# Altium schematic sheet 0_Architecture.SchDoc
size A4; Organization: SpaceLab UFSC; Address1: UFSC - SpaceLab; Address2: University Campus - Trindade; Address3: Dep. of Electrical Engineering - CTC; Address4: Florianópolis, Santa Catarina, Brazil; Revision: 1.0; Address5: CEP: 88040 - 900
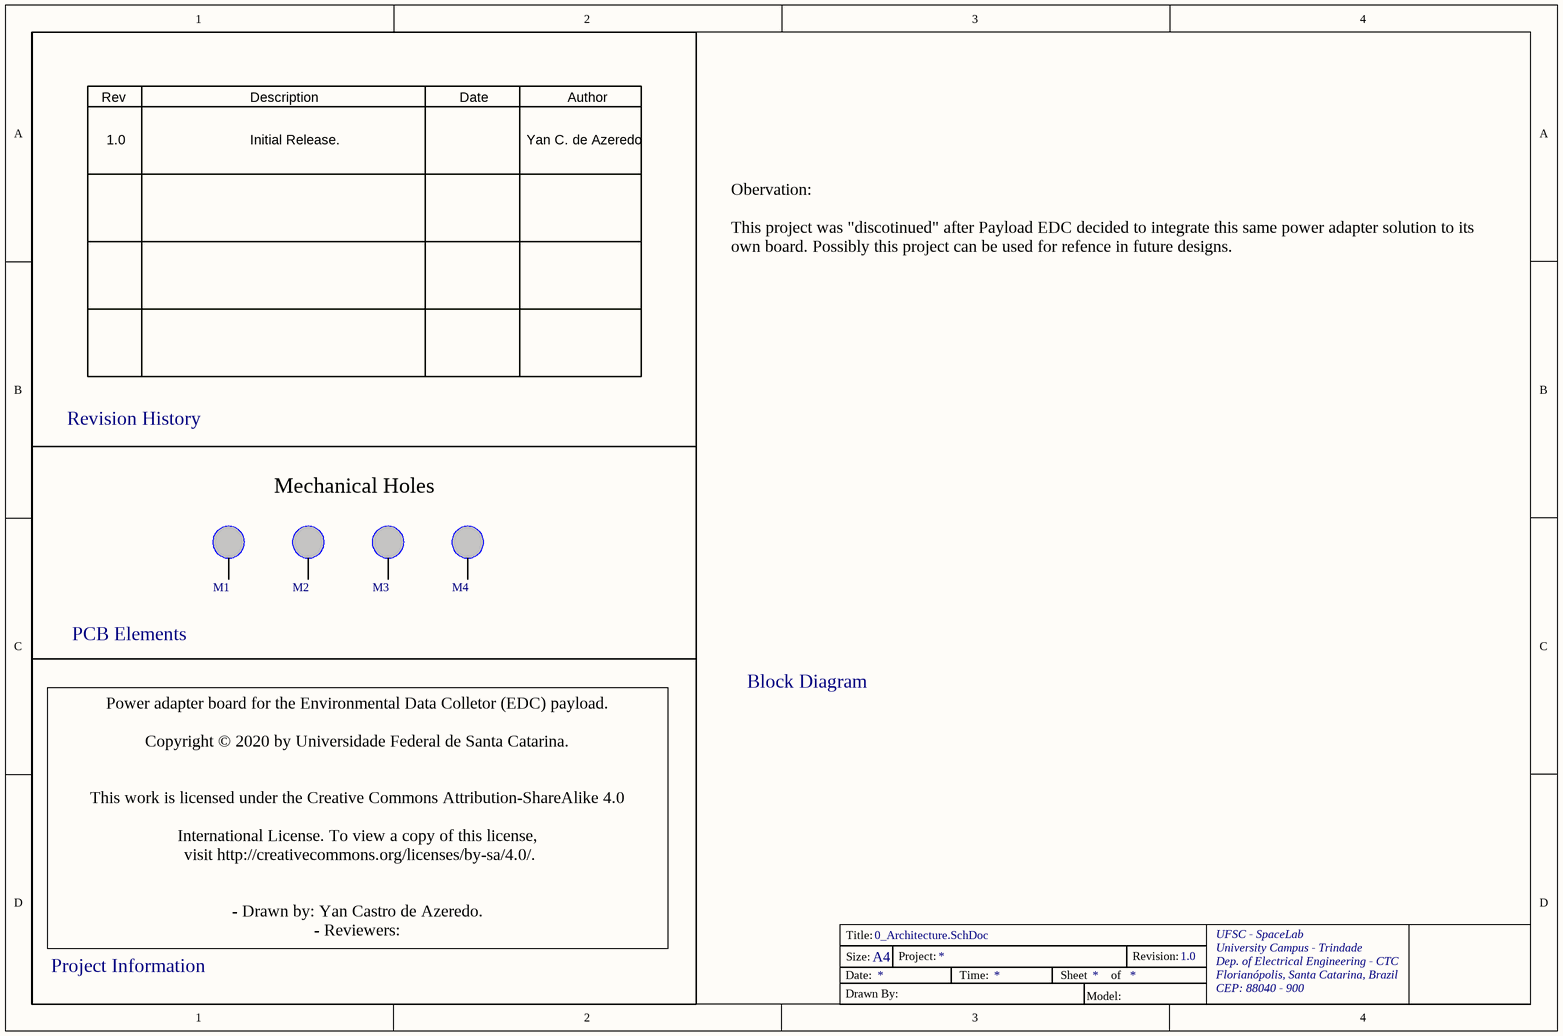
[diagram p0: 0_Architecture.SchDoc]

## Parts
M1  Mechanical hole 3.5mm  [Mechanical hole 3.5mm]  (value not drawn)  (no BOM)
M2  Mechanical hole 3.5mm  [Mechanical hole 3.5mm]  (value not drawn)  (no BOM)
M3  Mechanical hole 3.5mm  [Mechanical hole 3.5mm]  (value not drawn)  (no BOM)
M4  Mechanical hole 3.5mm  [Mechanical hole 3.5mm]  (value not drawn)  (no BOM)

## Nets

Not connected (* = marked no-connect by the designer): M1 0; M2 0; M3 0; M4 0

## Notes on the sheet
- Rev
- Description
- Date
- Author
- 1.0
- Initial Release.
- Yan C. de Azeredo
- Obervation:
  This project was "discotinued" after Payload EDC decided to integrate this same power adapter solution to its own board. Possibly this project can be used for refence in future designs.
- Revision History
- Mechanical Holes
- PCB Elements
- Block Diagram
- Power adapter board for the Environmental Data Colletor (EDC) payload.
  Copyright © 2020 by Universidade Federal de Santa Catarina.
  This work is licensed under the Creative Commons Attribution-ShareAlike 4.0
  International License. To view a copy of this license,
  visit http://creativecommons.org/licenses/by-sa/4.0/.
  - Drawn by: Yan Castro de Azeredo.
  - Reviewers:
  - Support: Gabriel Mariano Marcelino.
  - Mechanical validation:
- Project Information
- Date:
- Title:
- Size:
- A4
- Project:
- Time:
- Sheet
- of
- Revision:
- UFSC - SpaceLab
- University Campus - Trindade
- Dep. of Electrical Engineering - CTC
- Florianópolis, Santa Catarina, Brazil
- CEP: 88040 - 900
- Drawn By:
- Model: